# Altium schematic sheet Port.SchDoc
size 177 x 165 mm; SheetNumber: 1; SheetTotal: 1; SPICEModelCacheZMLSMFEG: <root> / <DocumentId>ZMLSMFEG</DocumentId> / <CacheFrame Number="0"> / <Model Name="dpsw2" Kind="CKT"> / <Text>* DIP switch 2 / * jjt 19/6/2002: created / * / *             Switch connections: / *             sw1 / *             |  |  sw2 / *             |  |  |  | / *             |  |  |  | / .subckt dpsw2 1  2  4  5 / + PARAMS: STATE1=0 STATE2=0 RON=1m ROFF=100E6 / * / V1 3 0 {STATE1} / V2 6 0 {STATE2} / * / SDIP1 1 2 3 0 DIPMOD / SDIP2 4 5 6 0 DIPMOD / * / .MODEL DIPMOD SW(VT=0.5 RON={RON} ROFF={ROFF}) / .ends dpsw2</Text> / </Model> / </CacheFrame> / </root>
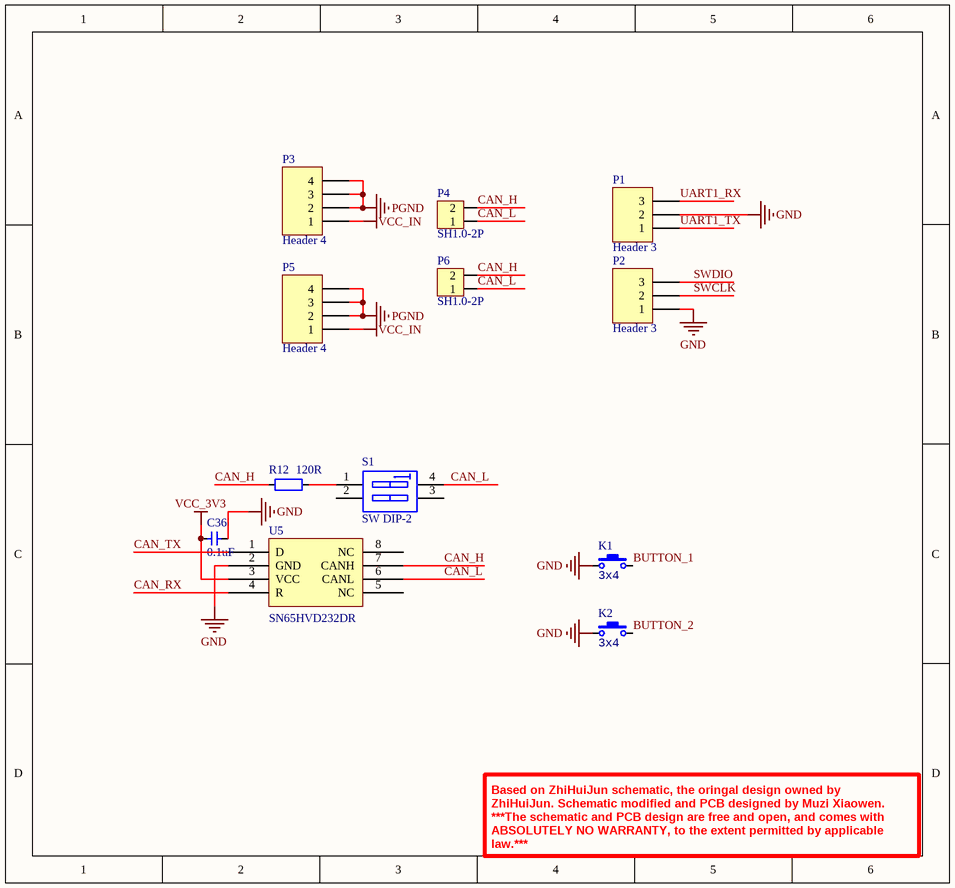
[diagram p0: Port.SchDoc]

## Parts
C36  0.1uF  [CAP_0402]
K1  value 3x4  [ButtonTACT_3x4x2_180]  (hidden comment: TACT 2P)
K2  value 3x4  [ButtonTACT_3x4x2_180]  (hidden comment: TACT 2P)
P1  Header 3  [HDR1X3]
P2  Header 3  [HDR1X3]
P3  Header 4  [CONN-SMD_2P-P2.00_HDGC_HDGC2001WR-S-2P]
P4  SH1.0-2P  [SH1.0-2P]
P5  Header 4  [CONN-SMD_2P-P2.00_HDGC_HDGC2001WR-S-2P]
P6  SH1.0-2P  [SH1.0-2P]
R12  120R  [RES_0402]
S1  SW DIP-2  [SW-SMD_DSHP02TS-S]
U5  Manufacturer Part Number: SN65HVD232DR  [so-8]  (hidden comment: SN65HVD232D)

## Nets
GND: C36.1 K1.1 K2.1 P1.2 P2.1 U5.2(GND)
PGND: P3.2 P3.3 P3.4 P5.2 P5.3 P5.4
VCC_3V3: C36.2 U5.3(VCC)
VCC_IN: P3.1 P5.1
BUTTON_1: K1.2
BUTTON_2: K2.2
CAN_H: P4.2 P6.2 R12.1 U5.7(CANH)
CAN_L: P4.1 P6.1 S1.4(B1) U5.6(CANL)
CAN_RX: U5.4(R)
CAN_TX: U5.1(D)
SWCLK: P2.2
SWDIO: P2.3
UART1_RX: P1.3
UART1_TX: P1.1
NetR12_2: R12.2 S1.1(A1)

Not connected (* = marked no-connect by the designer): S1 2(A2) 3(B2); U5 5(NC) 8(NC)

## Notes on the sheet
- Based on ZhiHuiJun schematic, the oringal design owned by ZhiHuiJun. Schematic modified and PCB designed by Muzi Xiaowen. ***The schematic and PCB design are free and open, and comes with ABSOLUTELY NO WARRANTY, to the extent permitted by applicable law.***

## Library data of the parts
C36 = 电容-0402: Capacitor; Value: 0.1u
K1 K2 = ButtonTACT_3x4x2_180: Button; type: TACT 2P
P1 P2 = Header 3: Header, 3-Pin; LatestRevisionDate: 17-Jul-2002; LatestRevisionNote: Re-released for DXP Platform.; Publisher: Altium Limited
P3 P5 = Header 4: Header, 4-Pin; LatestRevisionDate: 17-Jul-2002; LatestRevisionNote: Re-released for DXP Platform.; Publisher: Altium Limited
R12 = 电阻-0402: Resistor; Value: 22R
S1 = SW DIP-2: DIP Switch, 2 Position, SPST; Published: 24-Mar-1999; LatestRevisionDate: 17-Jul-2002; LatestRevisionNote: Re-released for DXP Platform.; PackageReference: DIP-4; Publisher: Altium Limited
U5 = SN65HVD232D: Manufacturer: Texas Instruments; Protocol: CAN; Number of Drivers/Receivers: 1/1; Duplex: Half; Data Rate: 1Mbps; Voltage - Supply: 3 V ~ 3.6 V; Supplier 1: Digi-Key; Supplier Part Number 1: 296-26344-2-ND; RoHS: RoHS Compliant; Category: Integrated Circuits (ICs); Stock: 5000; Pricing 1: 2500=0.84375 (USD); Packaging: Tape & Reel (TR); Part Status: Active; Type: Transceiver; Operating Temperature: -40°C ~ 85°C; Mounting Type: Surface Mount; Package / Case: 8-SOIC (0.154", 3.90mm Width); Supplier Device Package: 8-SOIC; ComponentLink1URL: http://www.ti.com/lit/ds/symlink/sn65hvd230.pdf; ComponentLink1Description: http://www.ti.com/lit/ds/symlink/sn65hvd230.pdf; Supplier 2: Digi-Key; Supplier Part Number 2: 296-26344-1-ND; Pricing 2: 1=2.05, 10=1.842, 100=1.4809, 500=1.21668, 1000=1.00811 (USD)